# EAGLE schematic robot_mini_r1 (EAGLE 6.4)
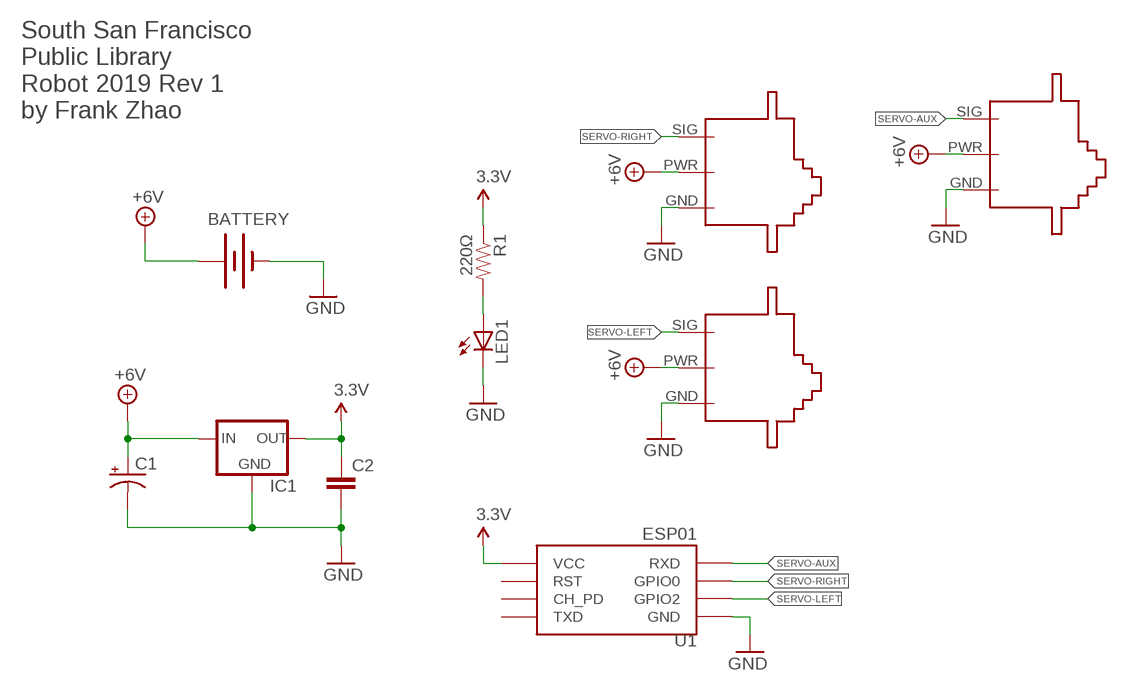
[diagram p0: schematic, sheet 1]

## Parts
BATTERY  BATTERY-WIRE-CONN  [BATT-WIRE-CONN]
C1  CAP_POLPTH1  [CPOL-RADIAL-100UF-25V]
C2  CAPPTH  [CAP-PTH-SMALL]
IC1  V_REG_78XXTO-92  [TO-92]
LED1  LED5MM  [LED5MM]
M1  SERVO-FLIPPED  [SERVO-FLIPPED]
M2  SERVO-1  [SERVO]
M3  SERVO-1  [SERVO]
R1  220Ω  RESISTORAXIAL-0.3-NOVAL  [AXIAL-0.3-NOVAL]
U1  ESP01  [ESP01]
U$9  TEXT-INFO-INVISIBLE  [TEXT-INFO-INVISIBLE]

## Nets
3.3V: C2.1 IC1.3(OUT) R1.P$1 U1.VCC
+6V: BATTERY.POS(+) C1.1(+) IC1.2(IN) M1.PWR M2.PWR M3.PWR
GND: BATTERY.NEG(-) C1.2(-) C2.2 IC1.1(GND) LED1.K(C) M1.GND M2.GND M3.GND U1.GND
N$9: LED1.A R1.P$2
SERVO-AUX: M3.SIG U1.RX(RXD)
SERVO-LEFT: M1.SIG U1.GPIO2
SERVO-RIGHT: M2.SIG U1.GPIO0
Unconnected: U1.CH_PD U1.RST U1.TX(TXD)

## Library data of the parts
BATTERY = robot:BATTERY: Battery Holders Various common sizes : AA, AAA, 20mm coin cell and 12mm coin cell.
C1 = robot:CAP_POL: Capacitor Polarized These are standard SMD and PTH capacitors. Normally 10uF, 47uF, and 100uF in electrolytic and tantalum varieties. Always verify the external diameter of the through hole cap, it varies with capacity, voltage, and manufacturer. The EIA devices should be standard.
C2 = robot:CAP: Capacitor Standard 0603 ceramic capacitor, and 0.1" leaded capacitor.
IC1 = robot:V_REG_78XX: Voltage Regulator Standard 7805 5V regulator. IGO (Input Ground Output). Spark Fun Electronics SKU : COM-00107
LED1 = robot:LED: LEDs Standard schematic elements and footprints for 5mm, 3mm, 1206, and 0603 sized LEDs. 5mm - Spark Fun Electronics SKU : COM-00529 (and others)
M1-M3 = robot:SERVO
R1 = robot:RESISTOR: Resistor Basic schematic elements and footprints for 0603, 1206, and PTH resistors.
U1 = robot:ESP01: ESP8266 Wifi module 01
U$9 = robot:TEXT-INFO